# Altium schematic sheet Shutdown_2019_v1.1_TractionCtl.SchDoc: Shutdown_2019_v1.1
size 453 x 301 mm; Date: 1/4/2019 10:42:25 PM; SheetNumber: 9; GateName_1: G$1; SymbolName_1: FRAME_B_L; LibraryName: frames; DeviceSetName: FRAME_B_L; GateName_2: G$2; SymbolName_2: DOCFIELD
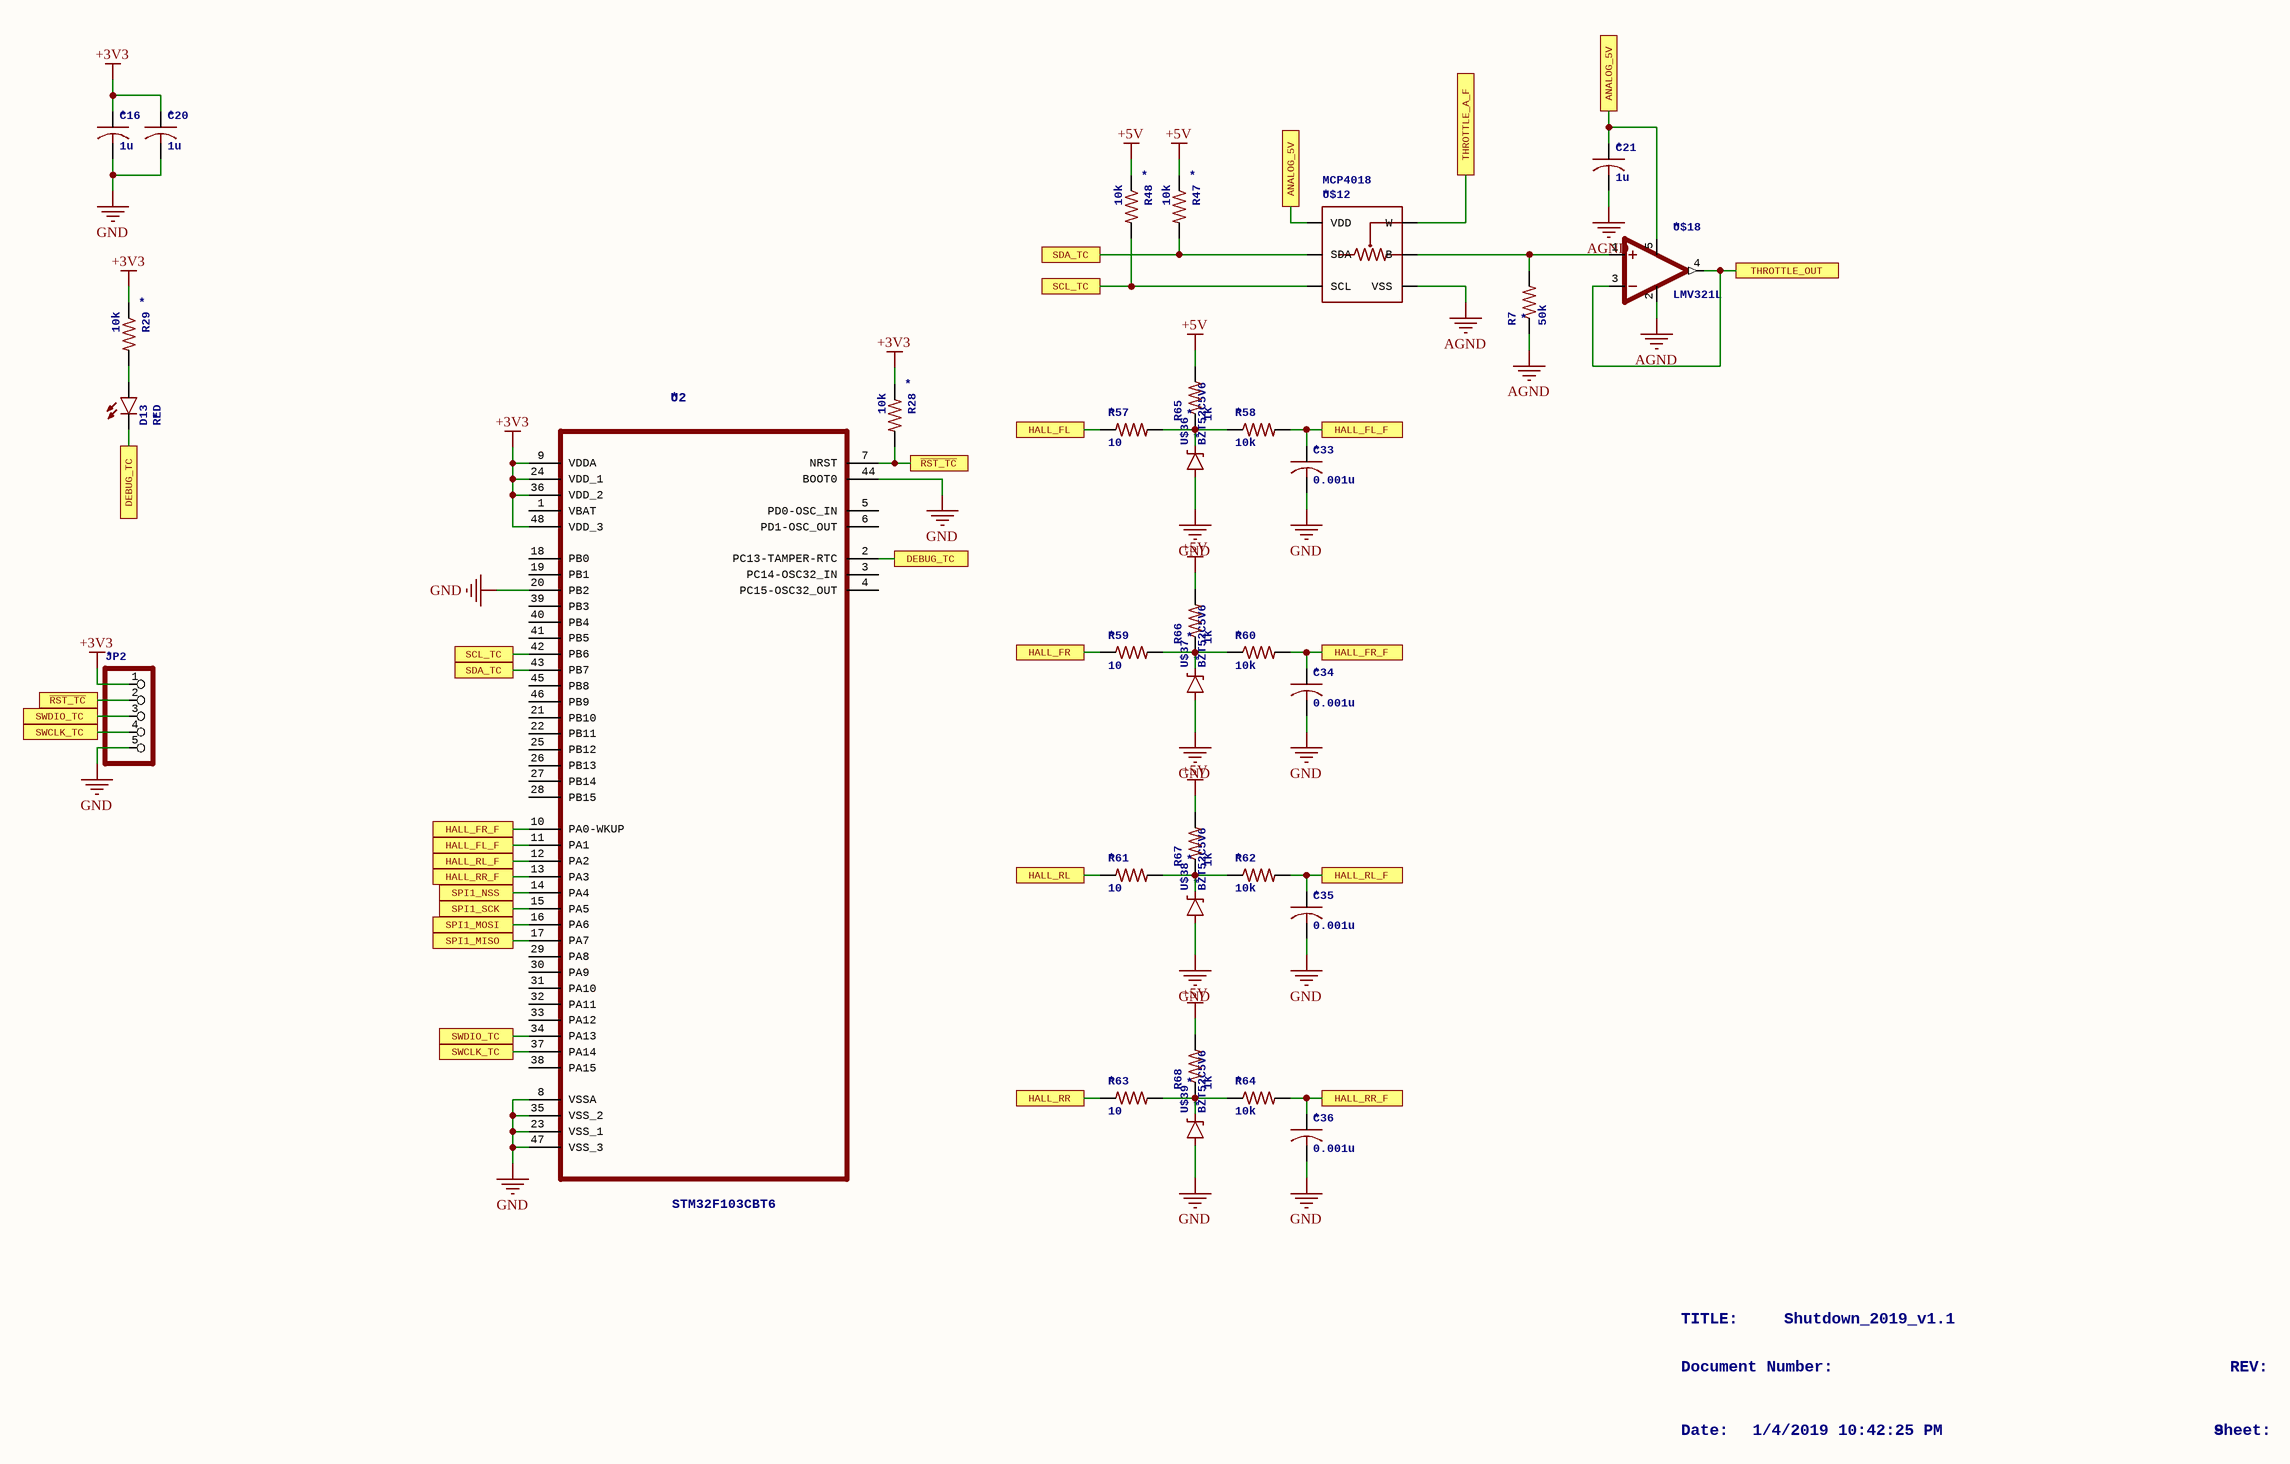
[diagram p0: Shutdown_2019_v1.1_TractionCtl.SchDoc]

## Parts
C16  1u  [C0805]
C20  1u  [C0805]
C21  1u  [C0603]
C33  0.001u  [C0805]
C34  0.001u  [C0805]
C35  0.001u  [C0805]
C36  0.001u  [C0805]
D13  RED  [LED-0603]
JP2  PINHD-1X5  [1X05]  (value not drawn)
R7  50k  [R0603]
R28  10k  [R0603]
R29  10k  [R0603]
R47  10k  [R0603]
R48  10k  [R0603]
R57  10  [R0603]
R58  10k  [R0603]
R59  10  [R0603]
R60  10k  [R0603]
R61  10  [R0603]
R62  10k  [R0603]
R63  10  [R0603]
R64  10k  [R0603]
R65  1k  [R0603]
R66  1k  [R0603]
R67  1k  [R0603]
R68  1k  [R0603]
U2  STM32F103CBT6  [QFP50P900X900X160-48N]
U$12  MCP4018  [SOT23-6]
U$18  LMV321L  [SOT23-5]
U$36  BZT52C5V6  [SOD-123]
U$37  BZT52C5V6  [SOD-123]
U$38  BZT52C5V6  [SOD-123]
U$39  BZT52C5V6  [SOD-123]

## Ports
ANALOG_5V, DEBUG_TC, HALL_FL, HALL_FL_F, HALL_FR, HALL_FR_F, HALL_RL, HALL_RL_F, HALL_RR, HALL_RR_F, SCL_TC, SDA_TC, SPI1_MISO, SPI1_MOSI, SPI1_NSS, SPI1_SCK, SWCLK_TC, SWDIO_TC, THROTTLE_A_F, THROTTLE_OUT, ~{RST_TC}

## Nets
+3V3: C16.1 C20.1 JP2.1 R28.1 R29.1 U2.9(VDDA) U2.24(VDD_1) U2.36(VDD_2) U2.48(VDD_3)
+5V: R47.1 R48.1 R65.2 R66.2 R67.2 R68.2
AGND: C21.2 R7.1 U$12.2(VSS) U$18.2(GND)
GND: C16.2 C20.2 C33.2 C34.2 C35.2 C36.2 JP2.5 U2.8(VSSA) U2.20(PB2) U2.23(VSS_1) U2.35(VSS_2) U2.44(BOOT0) U2.47(VSS_3) U$36.A U$37.A U$38.A U$39.A
ANALOG_5V: C21.1 U$12.1(VDD) U$18.5(VDD) ; port ANALOG_5V
DEBUG_TC: D13.C U2.2(PC13-TAMPER-RTC) ; port DEBUG_TC
HALL_FL: R57.1 ; port HALL_FL
HALL_FL_F: C33.1 R58.2 U2.11(PA1) ; port HALL_FL_F
HALL_FR: R59.1 ; port HALL_FR
HALL_FR_F: C34.1 R60.2 U2.10(PA0-WKUP) ; port HALL_FR_F
HALL_RL: R61.1 ; port HALL_RL
HALL_RL_F: C35.1 R62.2 U2.12(PA2) ; port HALL_RL_F
HALL_RR: R63.1 ; port HALL_RR
HALL_RR_F: C36.1 R64.2 U2.13(PA3) ; port HALL_RR_F
~{RST_TC}: JP2.2 R28.2 U2.7(NRST) ; port ~{RST_TC}
SCL_TC: R48.2 U2.42(PB6) U$12.3(SCL) ; port SCL_TC
SDA_TC: R47.2 U2.43(PB7) U$12.4(SDA) ; port SDA_TC
SPI1_MISO: U2.17(PA7) ; port SPI1_MISO
SPI1_MOSI: U2.16(PA6) ; port SPI1_MOSI
SPI1_NSS: U2.14(PA4) ; port SPI1_NSS
SPI1_SCK: U2.15(PA5) ; port SPI1_SCK
SWCLK_TC: JP2.4 U2.37(PA14) ; port SWCLK_TC
SWDIO_TC: JP2.3 U2.34(PA13) ; port SWDIO_TC
THROTTLE_A_F: U$12.6(W) ; port THROTTLE_A_F
THROTTLE_OUT: U$18.3(-IN) U$18.4(OUT) ; port THROTTLE_OUT
NetD13_A: D13.A R29.2
NetR7_2: R7.2 U$12.5(B) U$18.1(+IN)
NetR57_2: R57.2 R58.1 R65.1 U$36.C
NetR59_2: R59.2 R60.1 R66.1 U$37.C
NetR61_2: R61.2 R62.1 R67.1 U$38.C
NetR63_2: R63.2 R64.1 R68.1 U$39.C

Not connected (* = marked no-connect by the designer): U2 1(VBAT) 3(PC14-OSC32_IN) 4(PC15-OSC32_OUT) 5(PD0-OSC_IN) 6(PD1-OSC_OUT) 18(PB0) 19(PB1) 21(PB10) 22(PB11) 25(PB12) 26(PB13) 27(PB14) 28(PB15) 29(PA8) 30(PA9) 31(PA10) 32(PA11) 33(PA12) 38(PA15) 39(PB3) 40(PB4) 41(PB5) 45(PB8) 46(PB9)

## Notes on the sheet
- TITLE:
- Document Number:
- Shutdown_2019_v1.1
- REV:
- Date:
- 1/4/2019 10:42:25 PM
- Sheet:
- 9
- 1
- 2
- 3
- 4
- 5
- 6
- 7
- 8
- A
- B
- C
- D
- E
- F

## Library data of the parts
C16 C20 C33-C36 = C-USC0805: CAPACITOR, American symbol; GateName_1: G$1; SymbolName_1: C-US; DeviceName: C0805; LibraryName: rcl; DeviceSetName: C-US; NAME: *; SPICEPREFIX: C
C21 = C-USC0603: CAPACITOR, American symbol; GateName_1: G$1; SymbolName_1: C-US; DeviceName: C0603; LibraryName: rcl; DeviceSetName: C-US; NAME: *; SPICEPREFIX: C
D13 = LED-RED0603: Assorted Red LEDsLilyPad 1206- DIO-099121206- DIO-008090603- DIO-00819"SMART" means more efficient and expensive; GateName_1: G$1; SymbolName_1: LED; DeviceName: 0603; LibraryName: SparkFun-LED; DeviceSetName: LED-RED; NAME: *; PROD_ID: DIO-00819
JP2 = PINHD-1X5: PIN HEADER; GateName_1: A; SymbolName_1: PINHD5; LibraryName: Headers_IFE; DeviceSetName: PINHD-1X5; NAME: *
R7 R28 R29 R47 R48 R57-R68 = R-US_R0603: RESISTOR, American symbol; GateName_1: G$1; SymbolName_1: R-US; DeviceSetName: R-US_; DeviceName: R0603; LibraryName: rcl; NAME: *; SPICEPREFIX: R
U2 = STM32F103CBT6: Medium-density performance line ARM-based 32-bit MCU; GateName_1: A; SymbolName_1: STM32F103CBT6; LibraryName: ST Microelctronics_By_element14_Batch_1; DeviceSetName: STM32F103CBT6; MPN: STM32F103CBT6; NAME: *; OC_FARNELL: 1606327; OC_NEWARK: 11N8296; PACKAGE: QFP-48; SUPPLIER: STMICROELECTRONICS
U$12 = MCP4018: MICROCHIP MCP40187-Bit Single I2Câ„¢ Digital POT with Volatile Memory in SC70Datasheet; GateName_1: G$1; SymbolName_1: MCP4018; LibraryName: MICROCHIP; DeviceSetName: MCP4018; NAME: *
U$18 = LMV321L: STM LMV321LRail to Rail General Purpose Op-AmpDatasheet; GateName_1: G$1; SymbolName_1: OP-AMP; LibraryName: STM; DeviceSetName: LMV321L; NAME: *
U$36-U$39 = BZT52C: DIODES INC BZT52C Small form factor Zener Diode Datasheet; GateName_1: G$1; SymbolName_1: DIODE-ZENER; LibraryName: DIODES_INC; DeviceSetName: BZT52C; NAME: *